# Altium schematic sheet support.SchDoc: Support
size A4; DrawnBy: Adrianna Ascalon
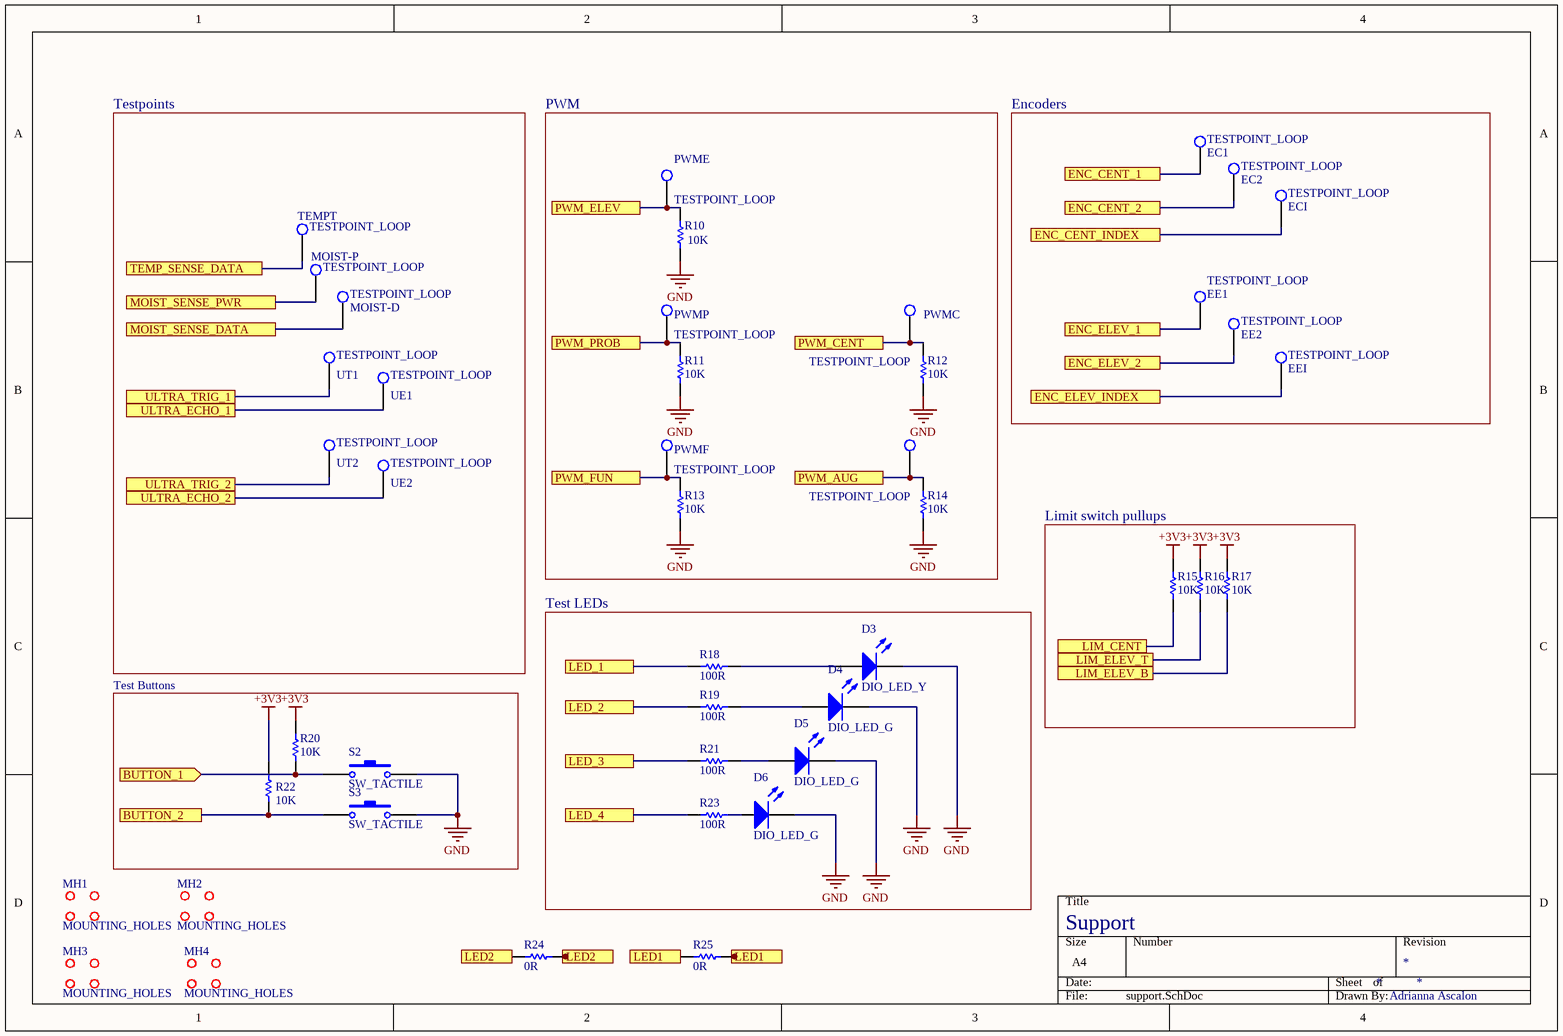
[diagram p0: support.SchDoc]

## Parts
D3  DIO_LED_Y  [LED_0805_LINE]
D4  DIO_LED_G  [LED_0805_LINE]
D5  DIO_LED_G  [LED_0805_LINE]
D6  DIO_LED_G  [LED_0805_LINE]
EC1  TESTPOINT_LOOP  [TESTPOINT_LOOP]
EC2  TESTPOINT_LOOP  [TESTPOINT_LOOP]
ECI  TESTPOINT_LOOP  [TESTPOINT_LOOP]
EE1  TESTPOINT_LOOP  [TESTPOINT_LOOP]
EE2  TESTPOINT_LOOP  [TESTPOINT_LOOP]
EEI  TESTPOINT_LOOP  [TESTPOINT_LOOP]
MH1  MOUNTING_HOLES  [MOUNTING_HOLE]
MH2  MOUNTING_HOLES  [MOUNTING_HOLE]
MH3  MOUNTING_HOLES  [MOUNTING_HOLE]
MH4  MOUNTING_HOLES  [MOUNTING_HOLE]
MOIST-D  TESTPOINT_LOOP  [TESTPOINT_LOOP]
MOIST-P  TESTPOINT_LOOP  [TESTPOINT_LOOP]
PWMA  TESTPOINT_LOOP  [TESTPOINT_LOOP]
PWMC  TESTPOINT_LOOP  [TESTPOINT_LOOP]
PWME  TESTPOINT_LOOP  [TESTPOINT_LOOP]
PWMF  TESTPOINT_LOOP  [TESTPOINT_LOOP]
PWMP  TESTPOINT_LOOP  [TESTPOINT_LOOP]
R10  value 10K  [RESC0603(1608)_N]  (hidden comment: RES_10K_0603)
R11  value 10K  [RESC0603(1608)_N]  (hidden comment: RES_10K_0603)
R12  value 10K  [RESC0603(1608)_N]  (hidden comment: RES_10K_0603)
R13  value 10K  [RESC0603(1608)_N]  (hidden comment: RES_10K_0603)
R14  value 10K  [RESC0603(1608)_N]  (hidden comment: RES_10K_0603)
R15  value 10K  [RESC0603(1608)_N]  (hidden comment: RES_10K_0603)
R16  value 10K  [RESC0603(1608)_N]  (hidden comment: RES_10K_0603)
R17  value 10K  [RESC0603(1608)_N]  (hidden comment: RES_10K_0603)
R18  value 100R  [RESC0603(1608)_N]  (hidden comment: RES_100R_0603)
R19  value 100R  [RESC0603(1608)_N]  (hidden comment: RES_100R_0603)
R20  value 10K  [RESC0603(1608)_N]  (hidden comment: RES_10K_0603)
R21  value 100R  [RESC0603(1608)_N]  (hidden comment: RES_100R_0603)
R22  value 10K  [RESC0603(1608)_N]  (hidden comment: RES_10K_0603)
R23  value 100R  [RESC0603(1608)_N]  (hidden comment: RES_100R_0603)
R24  value 0R  [RESC0603(1608)_N]  (hidden comment: RES_0R_0603)
R25  value 0R  [RESC0603(1608)_N]  (hidden comment: RES_0R_0603)
S2  SW_TACTILE  [B3U-1100P]
S3  SW_TACTILE  [B3U-1100P]
TEMPT  TESTPOINT_LOOP  [TESTPOINT_LOOP]
UE1  TESTPOINT_LOOP  [TESTPOINT_LOOP]
UE2  TESTPOINT_LOOP  [TESTPOINT_LOOP]
UT1  TESTPOINT_LOOP  [TESTPOINT_LOOP]
UT2  TESTPOINT_LOOP  [TESTPOINT_LOOP]

## Blocks framed on the sheet
Testpoints: MOIST-D MOIST-P TEMPT UE1 UE2 UT1 UT2
PWM: PWMA PWMC PWME PWMF PWMP R10-R14
Encoders: EC1 EC2 ECI EE1 EE2 EEI
Limit switch pullups: R15-R17
Test LEDs: D3-D6 R18 R19 R21 R23
Test Buttons: R20 R22 S2 S3

## Ports
BUTTON_1 (in), BUTTON_2, ENC_CENT_1, ENC_CENT_2, ENC_CENT_INDEX, ENC_ELEV_1, ENC_ELEV_2, ENC_ELEV_INDEX, LED1, LED2, LED_1, LED_2, LED_3, LED_4, LIM_CENT, LIM_ELEV_B, LIM_ELEV_T, MOIST_SENSE_DATA, MOIST_SENSE_PWR, PWM_AUG, PWM_CENT, PWM_ELEV, PWM_FUN, PWM_PROB, TEMP_SENSE_DATA, ULTRA_ECHO_1, ULTRA_ECHO_2, ULTRA_TRIG_1, ULTRA_TRIG_2

## Nets
+3V3: R15.2 R16.2 R17.2 R20.2 R22.1
GND: D3.2(K) D4.2(K) D5.2(K) D6.2(K) R10.1 R11.1 R12.1 R13.1 R14.1 S2.2 S3.2
BUTTON_1: R20.1 S2.1 ; port BUTTON_1
BUTTON_2: R22.2 S3.1 ; port BUTTON_2
ENC_CENT_1: EC1.1(=value) ; port ENC_CENT_1
ENC_CENT_2: EC2.1(=value) ; port ENC_CENT_2
ENC_CENT_INDEX: ECI.1(=value) ; port ENC_CENT_INDEX
ENC_ELEV_1: EE1.1(=value) ; port ENC_ELEV_1
ENC_ELEV_2: EE2.1(=value) ; port ENC_ELEV_2
ENC_ELEV_INDEX: EEI.1(=value) ; port ENC_ELEV_INDEX
LED1: R25.1 ; port LED1
LED2: R24.1 ; port LED2
LED_1: R18.1 ; port LED_1
LED_2: R19.1 ; port LED_2
LED_3: R21.1 ; port LED_3
LED_4: R23.1 ; port LED_4
LIM_CENT: R15.1 ; port LIM_CENT
LIM_ELEV_B: R17.1 ; port LIM_ELEV_B
LIM_ELEV_T: R16.1 ; port LIM_ELEV_T
MOIST_SENSE_DATA: MOIST-D.1(=value) ; port MOIST_SENSE_DATA
MOIST_SENSE_PWR: MOIST-P.1(=value) ; port MOIST_SENSE_PWR
PWM_AUG: PWMA.1(=value) R14.2 ; port PWM_AUG
PWM_CENT: PWMC.1(=value) R12.2 ; port PWM_CENT
PWM_ELEV: PWME.1(=value) R10.2 ; port PWM_ELEV
PWM_FUN: PWMF.1(=value) R13.2 ; port PWM_FUN
PWM_PROB: PWMP.1(=value) R11.2 ; port PWM_PROB
TEMP_SENSE_DATA: TEMPT.1(=value) ; port TEMP_SENSE_DATA
ULTRA_ECHO_1: UE1.1(=value) ; port ULTRA_ECHO_1
ULTRA_ECHO_2: UE2.1(=value) ; port ULTRA_ECHO_2
ULTRA_TRIG_1: UT1.1(=value) ; port ULTRA_TRIG_1
ULTRA_TRIG_2: UT2.1(=value) ; port ULTRA_TRIG_2
NetD3_1: D3.1(A) R18.2
NetD4_1: D4.1(A) R19.2
NetD5_1: D5.1(A) R21.2
NetD6_1: D6.1(A) R23.2

Not connected (* = marked no-connect by the designer): R24 2; R25 2

## Library data of the parts
D3 = DIO_LED_Y: LED YELLOW DIFFUSED 0805 SMD; Manufacturer: OSRAM; MPN: LY R976-PS-36; Forward Voltage Drop: 2.2V; Package: 0805 (2012 Metric); Digikey Part Number: 475-2560-1-ND
D4-D6 = DIO_LED_G: LED GREEN DIFFUSED 0805 SMD; Manufacturer: OSRAM; MPN: LG R971-KN-1; Forward Voltage Drop: 2.2V; Package: 0805 (2012 Metric); Digikey Part Number: 475-1410-1-ND
MH1-MH4 = MOUNTING_HOLES: 6cm x 6cm
R10-R17 R20 R22 = RES_10K_0603: RES SMD 10K OHM 5% 1/10W 0603; Manufacturer: Yageo; MPN: RC0603JR-0710KL; Package: 0603 (1608 Metric); Dimensions: 0.063" L x 0.031" W (1.60mm x 0.80mm); Tolerance: 5%; Digikey Part Number: 311-10KGRCT-ND
R18 R19 R21 R23 = RES_100R_0603: RES SMD 100 OHM 1% 1/10W 0603; Manufacturer: Yageo; MPN: RC0603FR-07100RL; Package: 0603 (1608 Metric); Dimensions: 0.063" L x 0.031" W (1.60mm x 0.80mm); Tolerance: 1%; Digikey Part Number: 311-100HRCT-ND
R24 R25 = RES_0R_0603: RES SMD 0 OHM JUMPER 1/10W 0603; Manufacturer: Yageo; MPN: RC0603JR-070RL; Package: 0603 (1608 Metric); Dimensions: 0.063" L x 0.031" W (1.60mm x 0.80mm); Digikey Part Number: 311-0.0GRCT-ND
S2 S3 = SW_TACTILE: Tactile Switch (Grey); Manufacturer: Omron Electronics Inc-EMC Div; Digikey Part Number: SW1021TR-ND; MPN: B3U-1100P